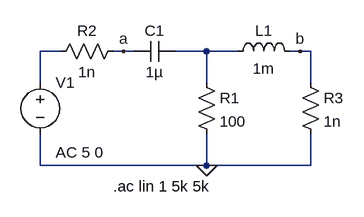
[diagram p0: schematic lab_4.asc]
lab_4.asc, the LTspice schematic file:
Version 4
SHEET 1 880 680
WIRE -208 80 -240 80
WIRE -112 80 -128 80
WIRE -96 80 -112 80
WIRE 16 80 -32 80
WIRE 64 80 16 80
WIRE 160 80 144 80
WIRE 176 80 160 80
WIRE -240 128 -240 80
WIRE 16 128 16 80
WIRE 176 128 176 80
WIRE -240 256 -240 208
WIRE 16 256 16 208
WIRE 16 256 -240 256
WIRE 176 256 176 208
WIRE 176 256 16 256
FLAG -112 80 a
FLAG 160 80 b
FLAG 16 256 0
SYMBOL res 0 112 R0
SYMATTR InstName R1
SYMATTR Value 100
SYMBOL ind 48 96 R270
WINDOW 0 32 56 VTop 2
WINDOW 3 5 56 VBottom 2
SYMATTR InstName L1
SYMATTR Value 1m
SYMATTR SpiceLine Rser=2.8
SYMBOL cap -32 64 R90
WINDOW 0 0 32 VBottom 2
WINDOW 3 32 32 VTop 2
SYMATTR InstName C1
SYMATTR Value 1µ
SYMBOL voltage -240 112 R0
WINDOW 123 24 124 Left 2
WINDOW 39 0 0 Left 0
SYMATTR InstName V1
SYMATTR Value ""
SYMATTR Value2 AC 5 0
SYMBOL res -224 96 R270
WINDOW 0 32 56 VTop 2
WINDOW 3 0 56 VBottom 2
SYMATTR InstName R2
SYMATTR Value 1n
SYMBOL res 160 112 R0
SYMATTR InstName R3
SYMATTR Value 1n
TEXT -128 288 Left 2 !.ac lin 1 5k 5k

The netlist it stands for:
* lab_4.asc
R1 N002 0 100
L1 N002 b 1m Rser=2.8
C1 N002 a 1µ
V1 N001 0 AC 5 0
R2 N001 a 1n
R3 b 0 1n
.ac lin 1 5k 5k
.backanno
.end